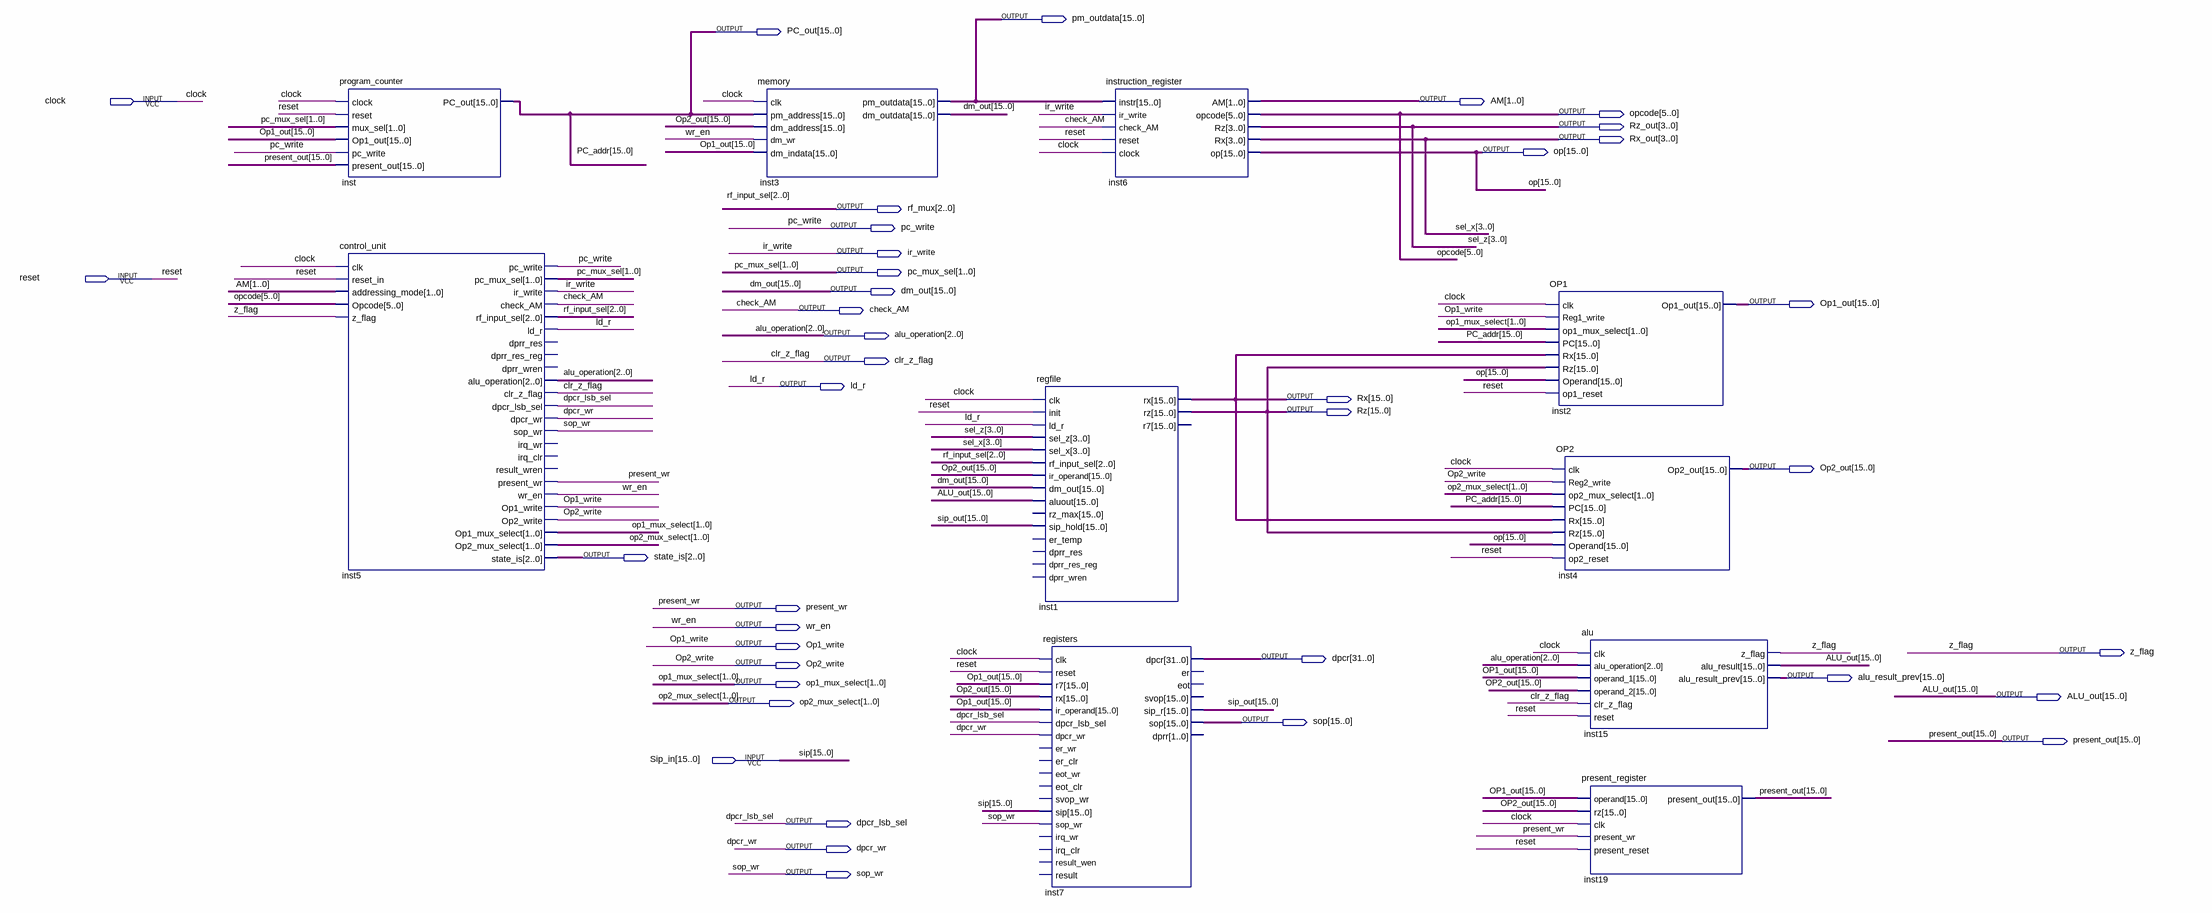
[diagram p0: schematic sheet]
// Quartus schematic fetch_decode_control.bdf as structural Verilog: 10 symbols, 39 pins
module fetch_decode_control (
  input  clock,
  input  reset,
  input  [15:0] Sip_in,
  output [15:0] pm_outdata,
  output [15:0] PC_out,
  output [1:0] AM,
  output [5:0] opcode,
  output [3:0] Rz_out,
  output [3:0] Rx_out,
  output [15:0] op,
  output [2:0] rf_mux,
  output pc_write,
  output ir_write,
  output [1:0] pc_mux_sel,
  output [15:0] dm_out,
  output [15:0] Op1_out,
  output check_AM,
  output [2:0] alu_operation,
  output clr_z_flag,
  output ld_r,
  output [15:0] Rx,
  output [15:0] Rz,
  output [15:0] Op2_out,
  output [2:0] state_is,
  output present_wr,
  output wr_en,
  output Op1_write,
  output z_flag,
  output [31:0] dpcr,
  output Op2_write,
  output [15:0] alu_result_prev,
  output [1:0] op1_mux_select,
  output [15:0] ALU_out,
  output [1:0] op2_mux_select,
  output [15:0] sop,
  output [15:0] present_out,
  output dpcr_lsb_sel,
  output dpcr_wr,
  output sop_wr
);

  wire [15:0] sip_out;

  program_counter inst (
    .clock(clock), .reset(reset), .mux_sel(pc_mux_sel), .Op1_out(Op1_out), .pc_write(pc_write),
    .present_out(present_out), .PC_out(PC_out));
  control_unit inst5 (
    .clk(clock), .reset_in(reset), .addressing_mode(AM), .Opcode(opcode), .z_flag(z_flag),
    .pc_write(pc_write), .pc_mux_sel(pc_mux_sel), .ir_write(ir_write), .check_AM(check_AM),
    .rf_input_sel(rf_mux), .ld_r(ld_r), .alu_operation(alu_operation), .clr_z_flag(clr_z_flag),
    .dpcr_lsb_sel(dpcr_lsb_sel), .dpcr_wr(dpcr_wr), .sop_wr(sop_wr), .present_wr(present_wr), .wr_en(wr_en),
    .Op1_write(Op1_write), .Op2_write(Op2_write), .Op1_mux_select(op1_mux_select),
    .Op2_mux_select(op2_mux_select), .state_is(state_is));  // open: dprr_res, dprr_res_reg, dprr_wren, irq_wr, irq_clr, result_wren
  memory inst3 (
    .clk(clock), .pm_address(PC_out), .dm_address(Op2_out), .dm_wr(wr_en), .dm_indata(Op1_out),
    .pm_outdata(pm_outdata), .dm_outdata(dm_out));
  regfile inst1 (
    .clk(clock), .init(reset), .ld_r(ld_r), .sel_z(Rz_out), .sel_x(Rx_out), .rf_input_sel(rf_mux),
    .ir_operand(Op2_out), .dm_out(dm_out), .aluout(ALU_out), .sip_hold(sip_out), .rx(Rx), .rz(Rz));  // open: rz_max, er_temp, dprr_res, dprr_res_reg, dprr_wren, r7
  registers inst7 (
    .clk(clock), .reset(reset), .r7(Op1_out), .rx(Op2_out), .ir_operand(Op1_out),
    .dpcr_lsb_sel(dpcr_lsb_sel), .dpcr_wr(dpcr_wr), .sip(Sip_in), .sop_wr(sop_wr), .dpcr(dpcr),
    .sip_r(sip_out), .sop(sop));  // open: er_wr, er_clr, eot_wr, eot_clr, svop_wr, irq_wr, irq_clr, result_wen, result, er, eot, svop, dprr
  instruction_register inst6 (
    .instr(pm_outdata), .ir_write(ir_write), .check_AM(check_AM), .reset(reset), .clock(clock), .AM(AM),
    .opcode(opcode), .Rz(Rz_out), .Rx(Rx_out), .op(op));
  OP1 inst2 (
    .clk(clock), .Reg1_write(Op1_write), .op1_mux_select(op1_mux_select), .PC(PC_out), .Rx(Rx), .Rz(Rz),
    .Operand(op), .op1_reset(reset), .Op1_out(Op1_out));
  OP2 inst4 (
    .clk(clock), .Reg2_write(Op2_write), .op2_mux_select(op2_mux_select), .PC(PC_out), .Rx(Rx), .Rz(Rz),
    .Operand(op), .op2_reset(reset), .Op2_out(Op2_out));
  alu inst15 (
    .clk(clock), .alu_operation(alu_operation), .operand_1(Op1_out), .operand_2(Op2_out),
    .clr_z_flag(clr_z_flag), .reset(reset), .z_flag(z_flag), .alu_result(ALU_out),
    .alu_result_prev(alu_result_prev));
  present_register inst19 (
    .operand(Op1_out), .rz(Op2_out), .clk(clock), .present_wr(present_wr), .present_reset(reset),
    .present_out(present_out));

  // Other names for the same wires on the sheet: PC_addr[15:0] = PC_out; rf_input_sel[2:0] = rf_mux;
  //   sel_x[3:0] = Rx_out; sel_z[3:0] = Rz_out; sip[15:0] = Sip_in
endmodule
